# Altium schematic sheet USB.SchDoc
size A4
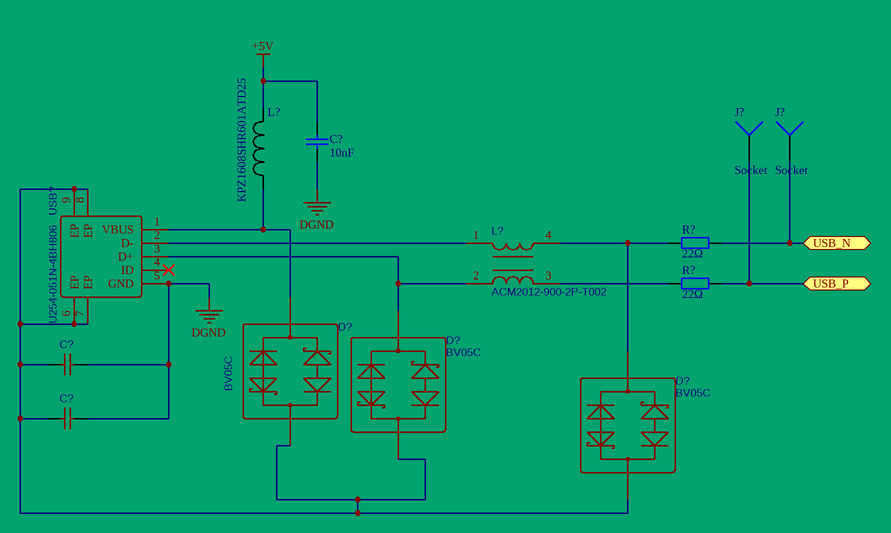
[diagram p0: USB.SchDoc]

## Parts
(Parts that share a designator on the sheet are numbered #1, #2 ... from top to bottom, then left to right.)
C?#1  10nF  [0603_C]
C?#2  1808 1nF(102) ±20% 5000V  [C1808]  (value not drawn)
C?#3  1808 1nF(102) ±20% 5000V  [C1808]  (value not drawn)
D?#1  BV05C  [SOD-323_L1.8-W1.3-LS2.5-BI]
D?#2  BV05C  [SOD-323_L1.8-W1.3-LS2.5-BI]
D?#3  BV05C  [SOD-323_L1.8-W1.3-LS2.5-BI]
J?#1  Socket  [PIN1]
J?#2  Socket  [PIN1]
L?#1  KPZ1608SHR601ATD25  [0603_L]
L?#2  ACM2012-900-2P-T002  [IND-SMD_4P-L2.0-W1.2-TL]
R?#1  22Ω  [0603_R]
R?#2  22Ω  [0603_R]
USB?  U254-051N-4BH806  [MICRO-USB-SMD_U254-051N-4BH806]

## Ports
USB_N, USB_P

## Nets
+5V: C?#1.2 L?#1.2
DGND: C?#1.1 C?#2.2 C?#3.2 USB?.5(GND)
USB_N: J?#2.1 R?#1.2 ; port USB_N
USB_P: J?#1.1 R?#2.2 ; port USB_P
NetC?#2_1: C?#2.1 C?#3.1 D?#1.1 D?#2.1 D?#3.1 USB?.6(EP) USB?.7(EP) USB?.8(EP) USB?.9(EP)
NetD?#1_2: D?#1.2 L?#1.1 USB?.1(VBUS)
NetD?#2_2: D?#2.2 L?#2.2 USB?.3(D+)
NetD?#3_2: D?#3.2 L?#2.4 R?#1.1
NetL?#2_1: L?#2.1 USB?.2(D-)
NetL?#2_3: L?#2.3 R?#2.1

Not connected (* = marked no-connect by the designer): USB? 4(ID)*

## Library data of the parts
C?#1 = 0603 1nF (102) 10% 50V: 贴片电容; BOM_Manufacturer Part: GRM188R72A103KA01D; BOM_Manufacturer: muRata; Package: 0603
C?#2 C?#3 = 1808 1nF(102) ±20% 5000V: BOM_Manufacturer: HEC; BOM_Manufacturer Part: C1808X102M502T0
D?#1-D?#3 = BV05C: BOM_Manufacturer: Bencent; BOM_Manufacturer Part: BV05C
L?#1 = KPZ1608SHR601ATD25: BOM_Manufacturer: TDK; BOM_Manufacturer Part: KPZ1608SHR601ATD25
L?#2 = ACM2012-900-2P-T002: BOM_Manufacturer: TDK; BOM_Supplier: LCSC; BOM_Manufacturer Part: ACM2012-900-2P-T002; BOM_Supplier Part: C19972; spicePre: L; spiceSymbolName: ACM2012-900-2P-T002
R?#1 R?#2 = 0603 2Ω (2R00) 1%: 贴片电阻; BOM_Manufacturer Part: ERJ3GEYJ220V; BOM_Manufacturer: PANASONIC
USB? = U254-051N-4BH806: microUSB; BOM_Manufacturer: XKB Enterprise; BOM_Manufacturer Part: U254-051N-4BH806
J?#1 J?#2 = Socket: LatestRevisionDate: 17-Jul-2002; LatestRevisionNote: Re-released for DXP Platform.; Publisher: Altium Limited